# Altium project Ground Station.PrjPcb
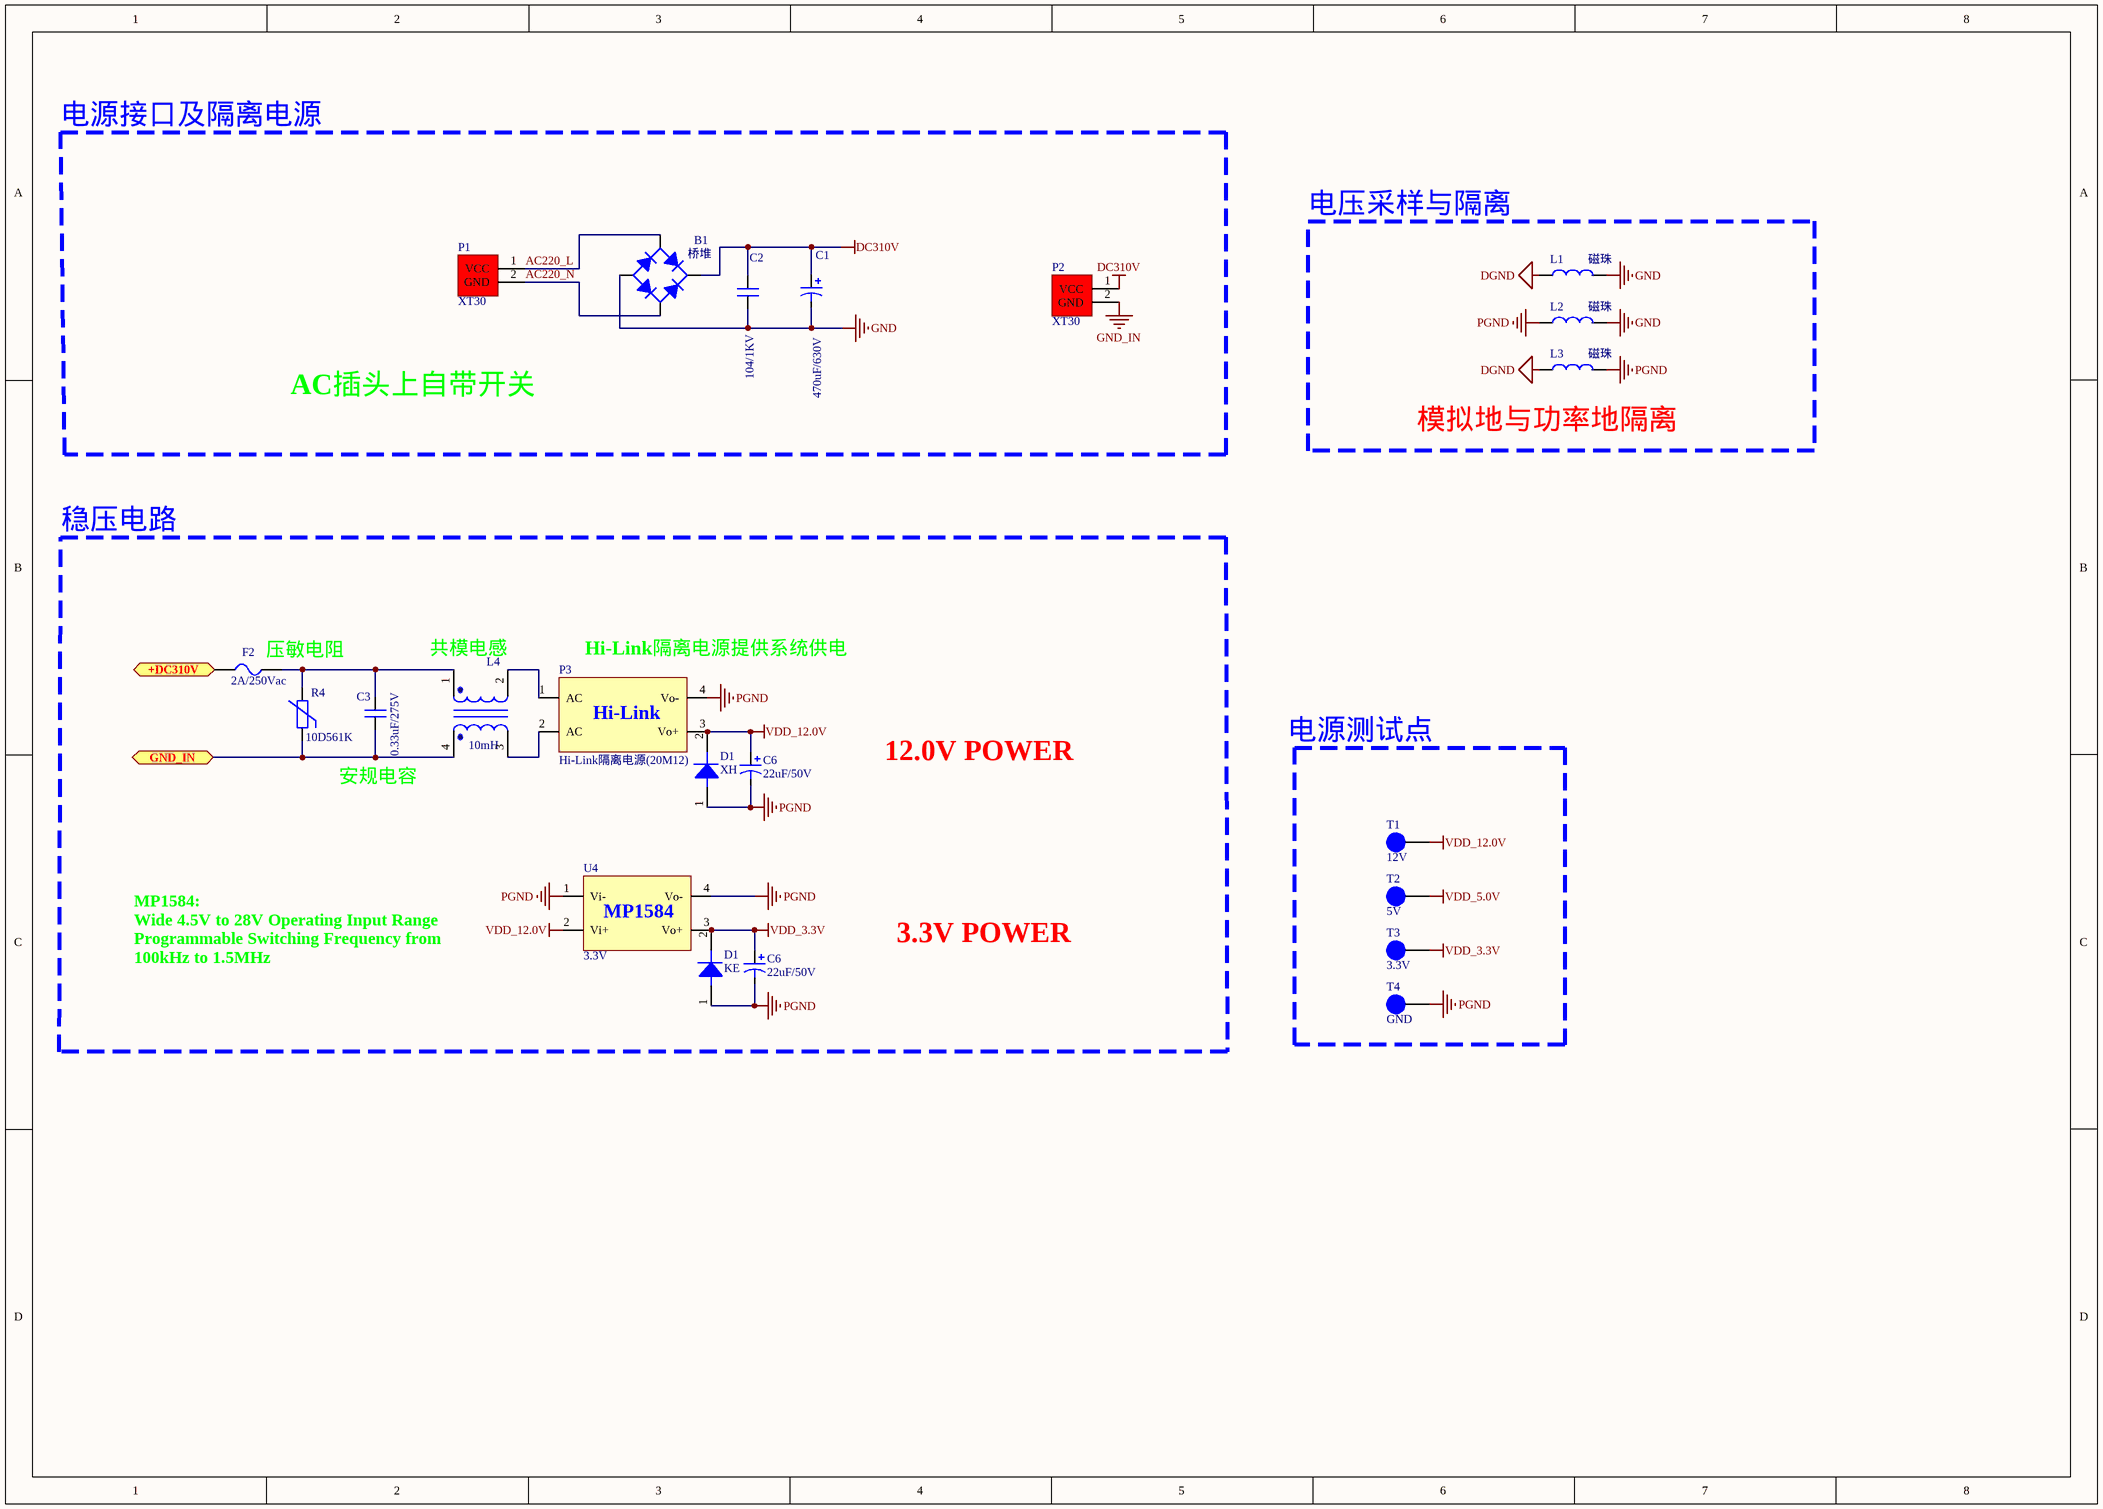
[diagram p0: power.SchDoc]
2 sheets, 34 parts. Net scope: flat (ports and power ports of the same name join across sheets).
Sheets:
  power.SchDoc
  core.SchDoc

## Sheet power.SchDoc
size A3

### Parts
(Parts that share a designator on the sheet are numbered #1, #2 ... from top to bottom, then left to right.)
B1  桥堆
C1  470uF/630V  [RB.3.6]
C2  104/1KV  [无极性直插电容]
C3  0.33uF/275V  [CX 15*18*11]
C6#1  22uF/50V  [CM D(6.3*5.4)]
C6#2  22uF/50V  [CM D(6.3*5.4)]
D1#1  XH  [SMA]
D1#2  KE  [SMA]
F2  2A/250Vac  [FU 5x20]
L1  磁珠  [1206L]
L2  磁珠  [1206L]
L3  磁珠  [1206L]
L4  10mH  [T12x6x4]
P1  XT30  [XT30PW-F]
P2  XT30  [XT30PW-F]
P3  Hi-Link隔离电源(20M12)  [HLK-20M24]
R4  10D561K  [VDR 10D-4.5]
T1  12V  [HEADER 1]
T2  5V  [HEADER 1]
T3  3.3V  [HEADER 1]
T4  GND  [HEADER 1]
U4  3.3V  [MP1584电源模块]

### Ports
+DC310V, GND_IN

### Nets
DC310V: B1.DC+ C1.1 C2.2 P2.1(VCC)
DGND: L1.1 L3.1
GND: B1.DC- C1.2 C2.1 L1.2 L2.2
GND_IN: P2.2(GND)
PGND: C6#1.2 C6#2.2 D1#1.1 D1#2.1 L2.1 L3.2 P3.4(Vo-) T4.1 U4.1(Vi-) U4.4(Vo-)
VDD_3.3V: C6#2.1 D1#2.2 T3.1 U4.3(Vo+)
VDD_5.0V: T2.1
VDD_12.0V: C6#1.1 D1#1.2 P3.3(Vo+) T1.1 U4.2(Vi+)
AC220_L: B1.AC1 P1.1(VCC)
AC220_N: B1.AC2 P1.2(GND)
NetC3_1: C3.1 L4.4 R4.1 ; port GND_IN
NetC3_2: C3.2 F2.2 L4.1 R4.2
NetF2_1: F2.1 ; port +DC310V
NetL4_2: L4.2 P3.1(AC)
NetL4_3: L4.3 P3.2(AC)

### Notes on the sheet
- 电源接口及隔离电源
- 电压采样与隔离
- AC插头上自带开关
- (near L3) 模拟地与功率地隔离
- 稳压电路
- (near F2) 压敏电阻
- (near L4) 共模电感
- (near P3) Hi-Link隔离电源提供系统供电
- 安规电容
- 12.0V POWER
- 电源测试点
- MP1584:
  Wide 4.5V to 28V Operating Input Range
  Programmable Switching Frequency from
  100kHz to 1.5MHz
- 3.3V POWER
- (in symbol HILINK-24V) Hi-Link
- (in symbol MP1584电源模块) MP1584

### Library data of the parts
C1 C6#1 C6#2 = Cap3: 直插极性电容
C2 = Cap2: 无极直插电容
C3 = Cap2: 安规电容
D1#1 D1#2 = Diode: 二极管
F2 = Fuse: 保险丝
L1-L3 = L: 电感
L4 = 共模电感
P1 P2 = 电源端子
P3 = HILINK-24V
R4 = 压敏电阻
T1-T4 = 测试点
U4 = MP1584电源模块

## Sheet core.SchDoc
size A3
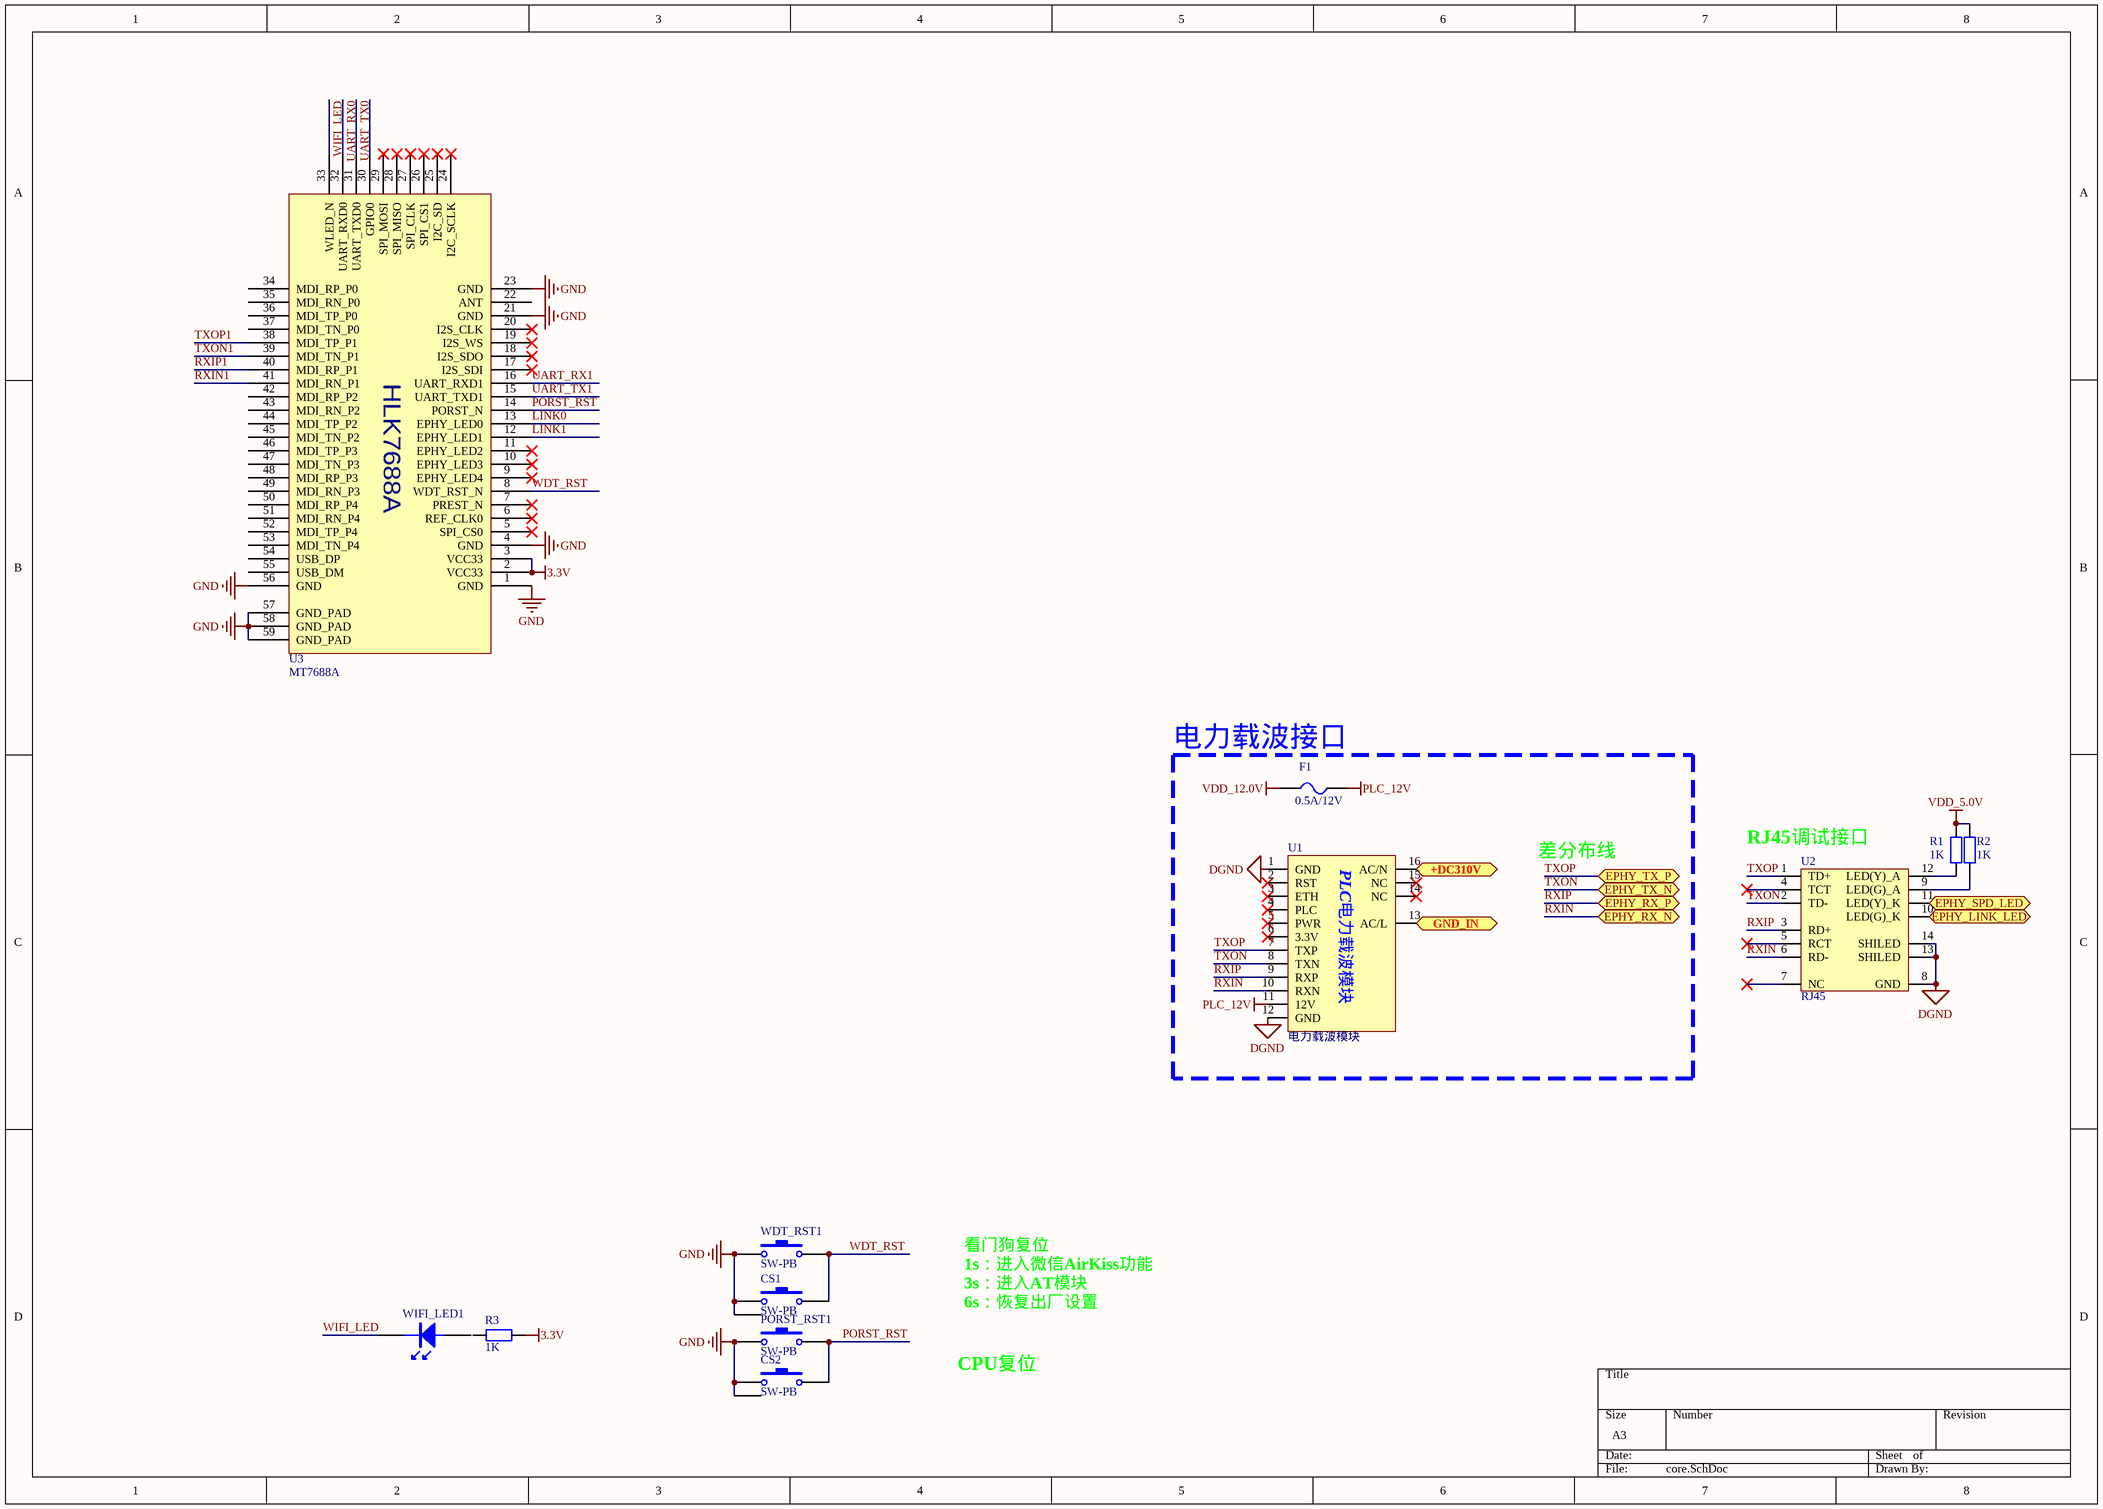
[diagram p1: core.SchDoc]

### Parts
CS1  SW-PB  [K5]
CS2  SW-PB  [K5]
F1  0.5A/12V  [1206F]
PORST_RST1  SW-PB  [SWITCH]
R1  1K  [0805R]
R2  1K  [0805R]
R3  1K  [0805R]
U1  电力载波模块  [电力载波模块6410（贴片排母）]
U2  RJ45  [RJ45]
U3  MT7688A  [MT7688A]
WDT_RST1  SW-PB  [SWITCH]
WIFI_LED1  (no value)  [0603LED]

### Blocks framed on the sheet
电力载波接口: F1 U1

### Ports
+DC310V, EPHY_LINK_LED, EPHY_RX_N, EPHY_RX_P, EPHY_SPD_LED, EPHY_TX_N, EPHY_TX_P, GND_IN

### Nets
3.3V: R3.2 U3.2(VCC33) U3.3(VCC33)
DGND: U1.1(GND) U1.12(GND) U2.8(GND) U2.13(SHILED) U2.14(SHILED)
GND: CS1.1 CS1.3 CS2.1 CS2.3 PORST_RST1.1 U3.1(GND) U3.4(GND) U3.21(GND) U3.23(GND) U3.56(GND) U3.57(GND_PAD) U3.58(GND_PAD) U3.59(GND_PAD) WDT_RST1.1
PLC_12V: F1.2 U1.11(12V)
VDD_5.0V: R1.1 R2.1
VDD_12.0V: F1.1
LINK0: U3.13(EPHY_LED0)
LINK1: U3.12(EPHY_LED1)
PORST_RST: CS2.2 PORST_RST1.2 U3.14(PORST_N)
RXIN: U1.10(RXN) U2.6(RD-) ; port EPHY_RX_N
RXIN1: U3.41(MDI_RN_P1)
RXIP: U1.9(RXP) U2.3(RD+) ; port EPHY_RX_P
RXIP1: U3.40(MDI_RP_P1)
TXON: U1.8(TXN) U2.2(TD-) ; port EPHY_TX_N
TXON1: U3.39(MDI_TN_P1)
TXOP: U1.7(TXP) U2.1(TD+) ; port EPHY_TX_P
TXOP1: U3.38(MDI_TP_P1)
UART_RX0: U3.32(UART_RXD0)
UART_RX1: U3.16(UART_RXD1)
UART_TX0: U3.31(UART_TXD0)
UART_TX1: U3.15(UART_TXD1)
WDT_RST: CS1.2 U3.8(WDT_RST_N) WDT_RST1.2
WIFI_LED: U3.33(WLED_N) WIFI_LED1.2
NetC3_1: U1.13(AC/L) ; port GND_IN
NetF2_1: U1.16(AC/N) ; port +DC310V
NetR1_2: R1.2 U2.12(LED(Y)_A)
NetR2_2: R2.2 U2.9(LED(G)_A)
NetU2_10: U2.10(LED(G)_K) ; port EPHY_LINK_LED
NetU2_11: U2.11(LED(Y)_K) ; port EPHY_SPD_LED

Not connected (* = marked no-connect by the designer): R3 1; U1 2(RST)* 3(ETH)* 4(PLC)* 5(PWR)* 6(3.3V)* 14(NC)* 15(NC)*; U2 4(TCT)* 5(RCT)* 7(NC)*; U3 5(SPI_CS0)* 6(REF_CLK0)* 7(PREST_N)* 9(EPHY_LED4)* 10(EPHY_LED3)* 11(EPHY_LED2)* 17(I2S_SDI)* 18(I2S_SDO)* 19(I2S_WS)* 20(I2S_CLK)* 22(ANT) 24(I2C_SCLK)* 25(I2C_SD)* 26(SPI_CS1)* 27(SPI_CLK)* 28(SPI_MISO)* 29(SPI_MOSI)* 30(GPIO0) 34(MDI_RP_P0) 35(MDI_RN_P0) 36(MDI_TP_P0) 37(MDI_TN_P0) 42(MDI_RP_P2) 43(MDI_RN_P2) 44(MDI_TP_P2) 45(MDI_TN_P2) 46(MDI_TP_P3) 47(MDI_TN_P3) 48(MDI_RP_P3) 49(MDI_RN_P3) 50(MDI_RP_P4) 51(MDI_RN_P4) 52(MDI_TP_P4) 53(MDI_TN_P4) 54(USB_DP) 55(USB_DM); WIFI_LED1 1

### Notes on the sheet
- 差分布线
- (near U2) RJ45调试接口
- 看门狗复位
  1s：进入微信AirKiss功能
  3s：进入AT模块
  6s：恢复出厂设置
- CPU复位
- (in symbol MT7688A) HLK7688A
- (in symbol 电力载波模块6410) PLC电力载波模块

### Library data of the parts
CS1 CS2 PORST_RST1 WDT_RST1 = SW-PB: Switch; Published: 24-Mar-1999; LatestRevisionDate: 17-Jul-2002; LatestRevisionNote: Re-released for DXP Platform.; PackageReference: SPST-2; Publisher: Altium Limited
F1 = Fuse: 保险丝
R1-R3 = Res: 电阻
U1 = 电力载波模块6410
U3 = MT7688A: MT7688A模组
WIFI_LED1 = LED

## Nets that join several sheets
DGND: power (L1.1 L3.1), core (5 pins)
GND: power (5 pins), core (14 pins)
VDD_5.0V: power (T2.1), core (R1.1 R2.1)
VDD_12.0V: power (5 pins), core (F1.1)
NetC3_1: power (C3.1 L4.4 R4.1), core (U1.13)
NetF2_1: power (F2.1), core (U1.16)